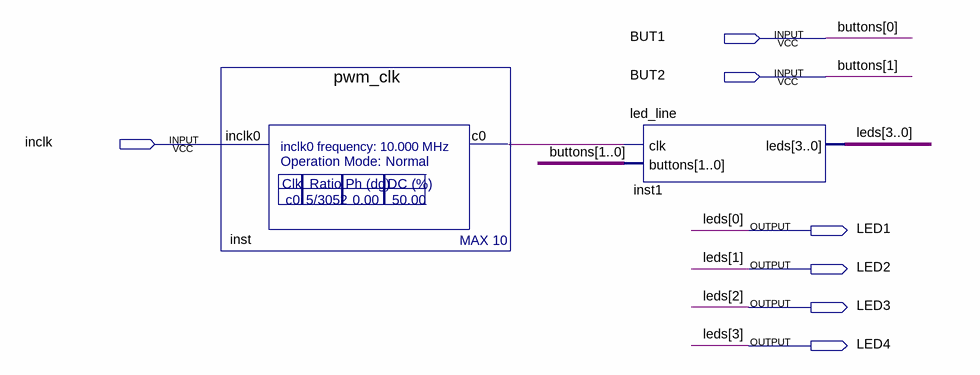
[diagram p0: schematic sheet]
// Quartus schematic 7seg_pwm.bdf as structural Verilog: 2 symbols, 7 pins
module \7seg_pwm  (
  input  BUT1,
  input  BUT2,
  input  inclk,
  output LED1,
  output LED2,
  output LED3,
  output LED4
);

  wire inst_c0;

  pwm_clk inst (.inclk0(inclk), .c0(inst_c0));
  led_line inst1 (.clk(inst_c0), .buttons({BUT2, BUT1}), .leds({LED4, LED3, LED2, LED1}));

  // Other names for the same wires on the sheet: buttons[1:0] = {BUT2, BUT1}; leds[3:0] = {LED4, LED3, LED2, LED1}
endmodule
